# Altium project maXTouch_Xplained_Pro.PRJPCB
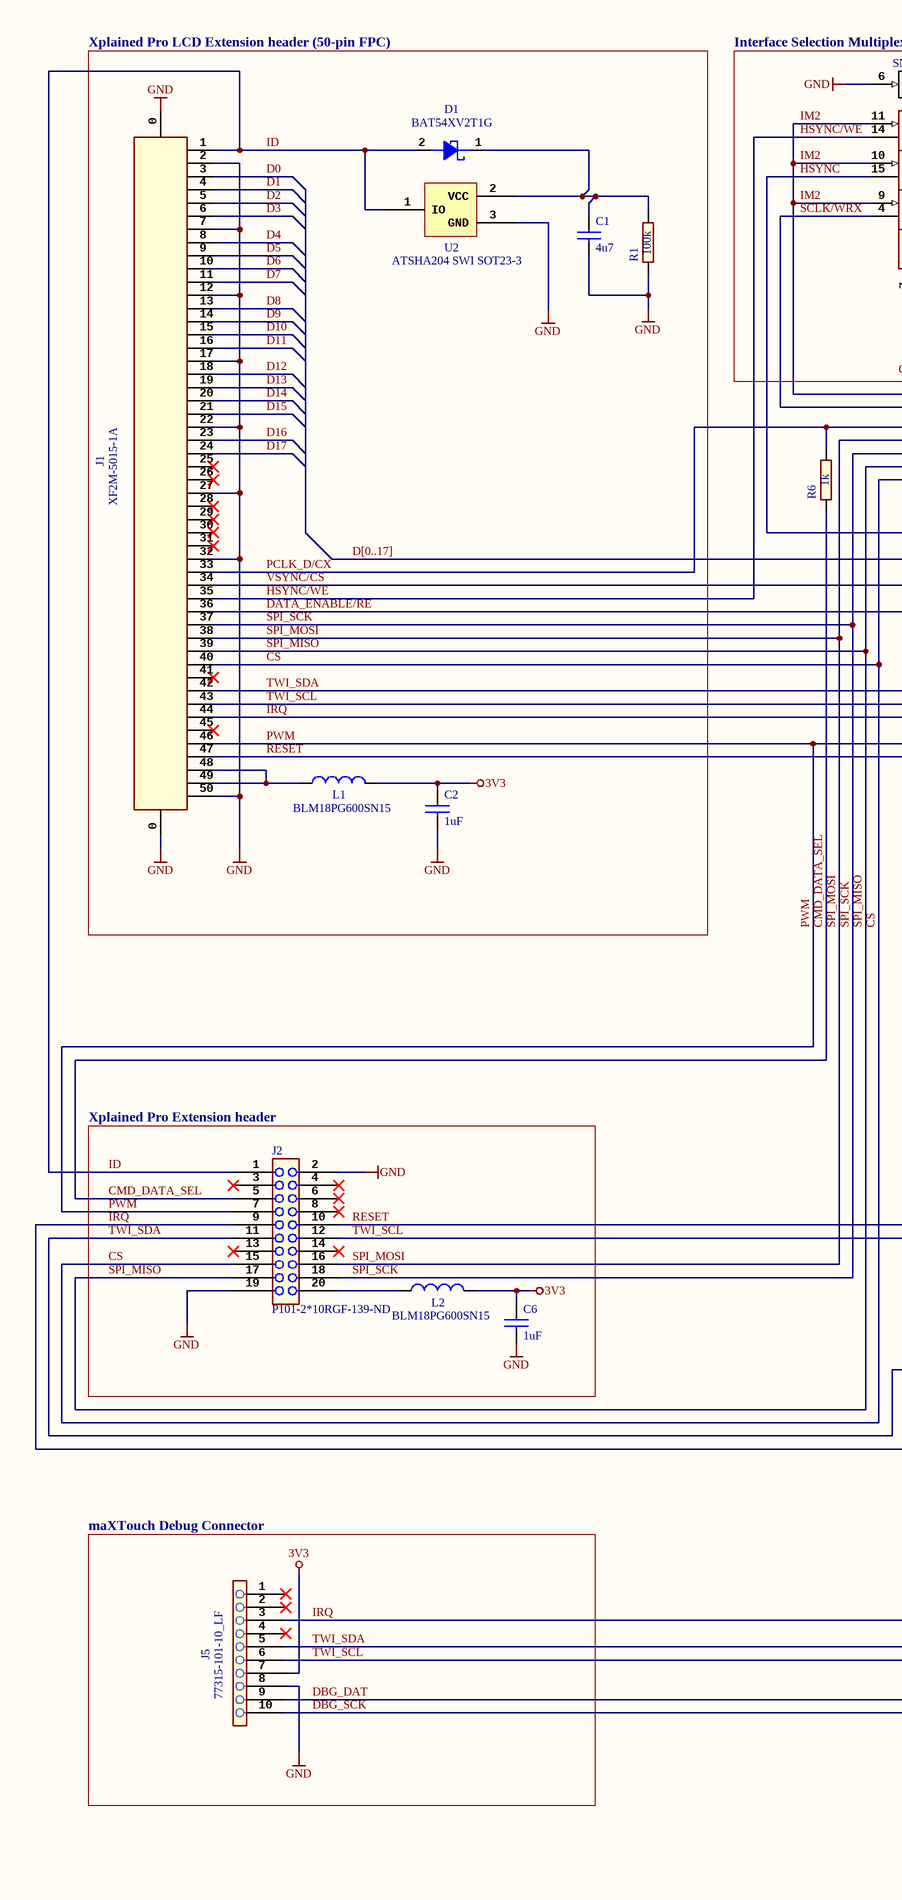
[diagram p0: maXTouch_Xplained_Pro.SCHDOC, left]
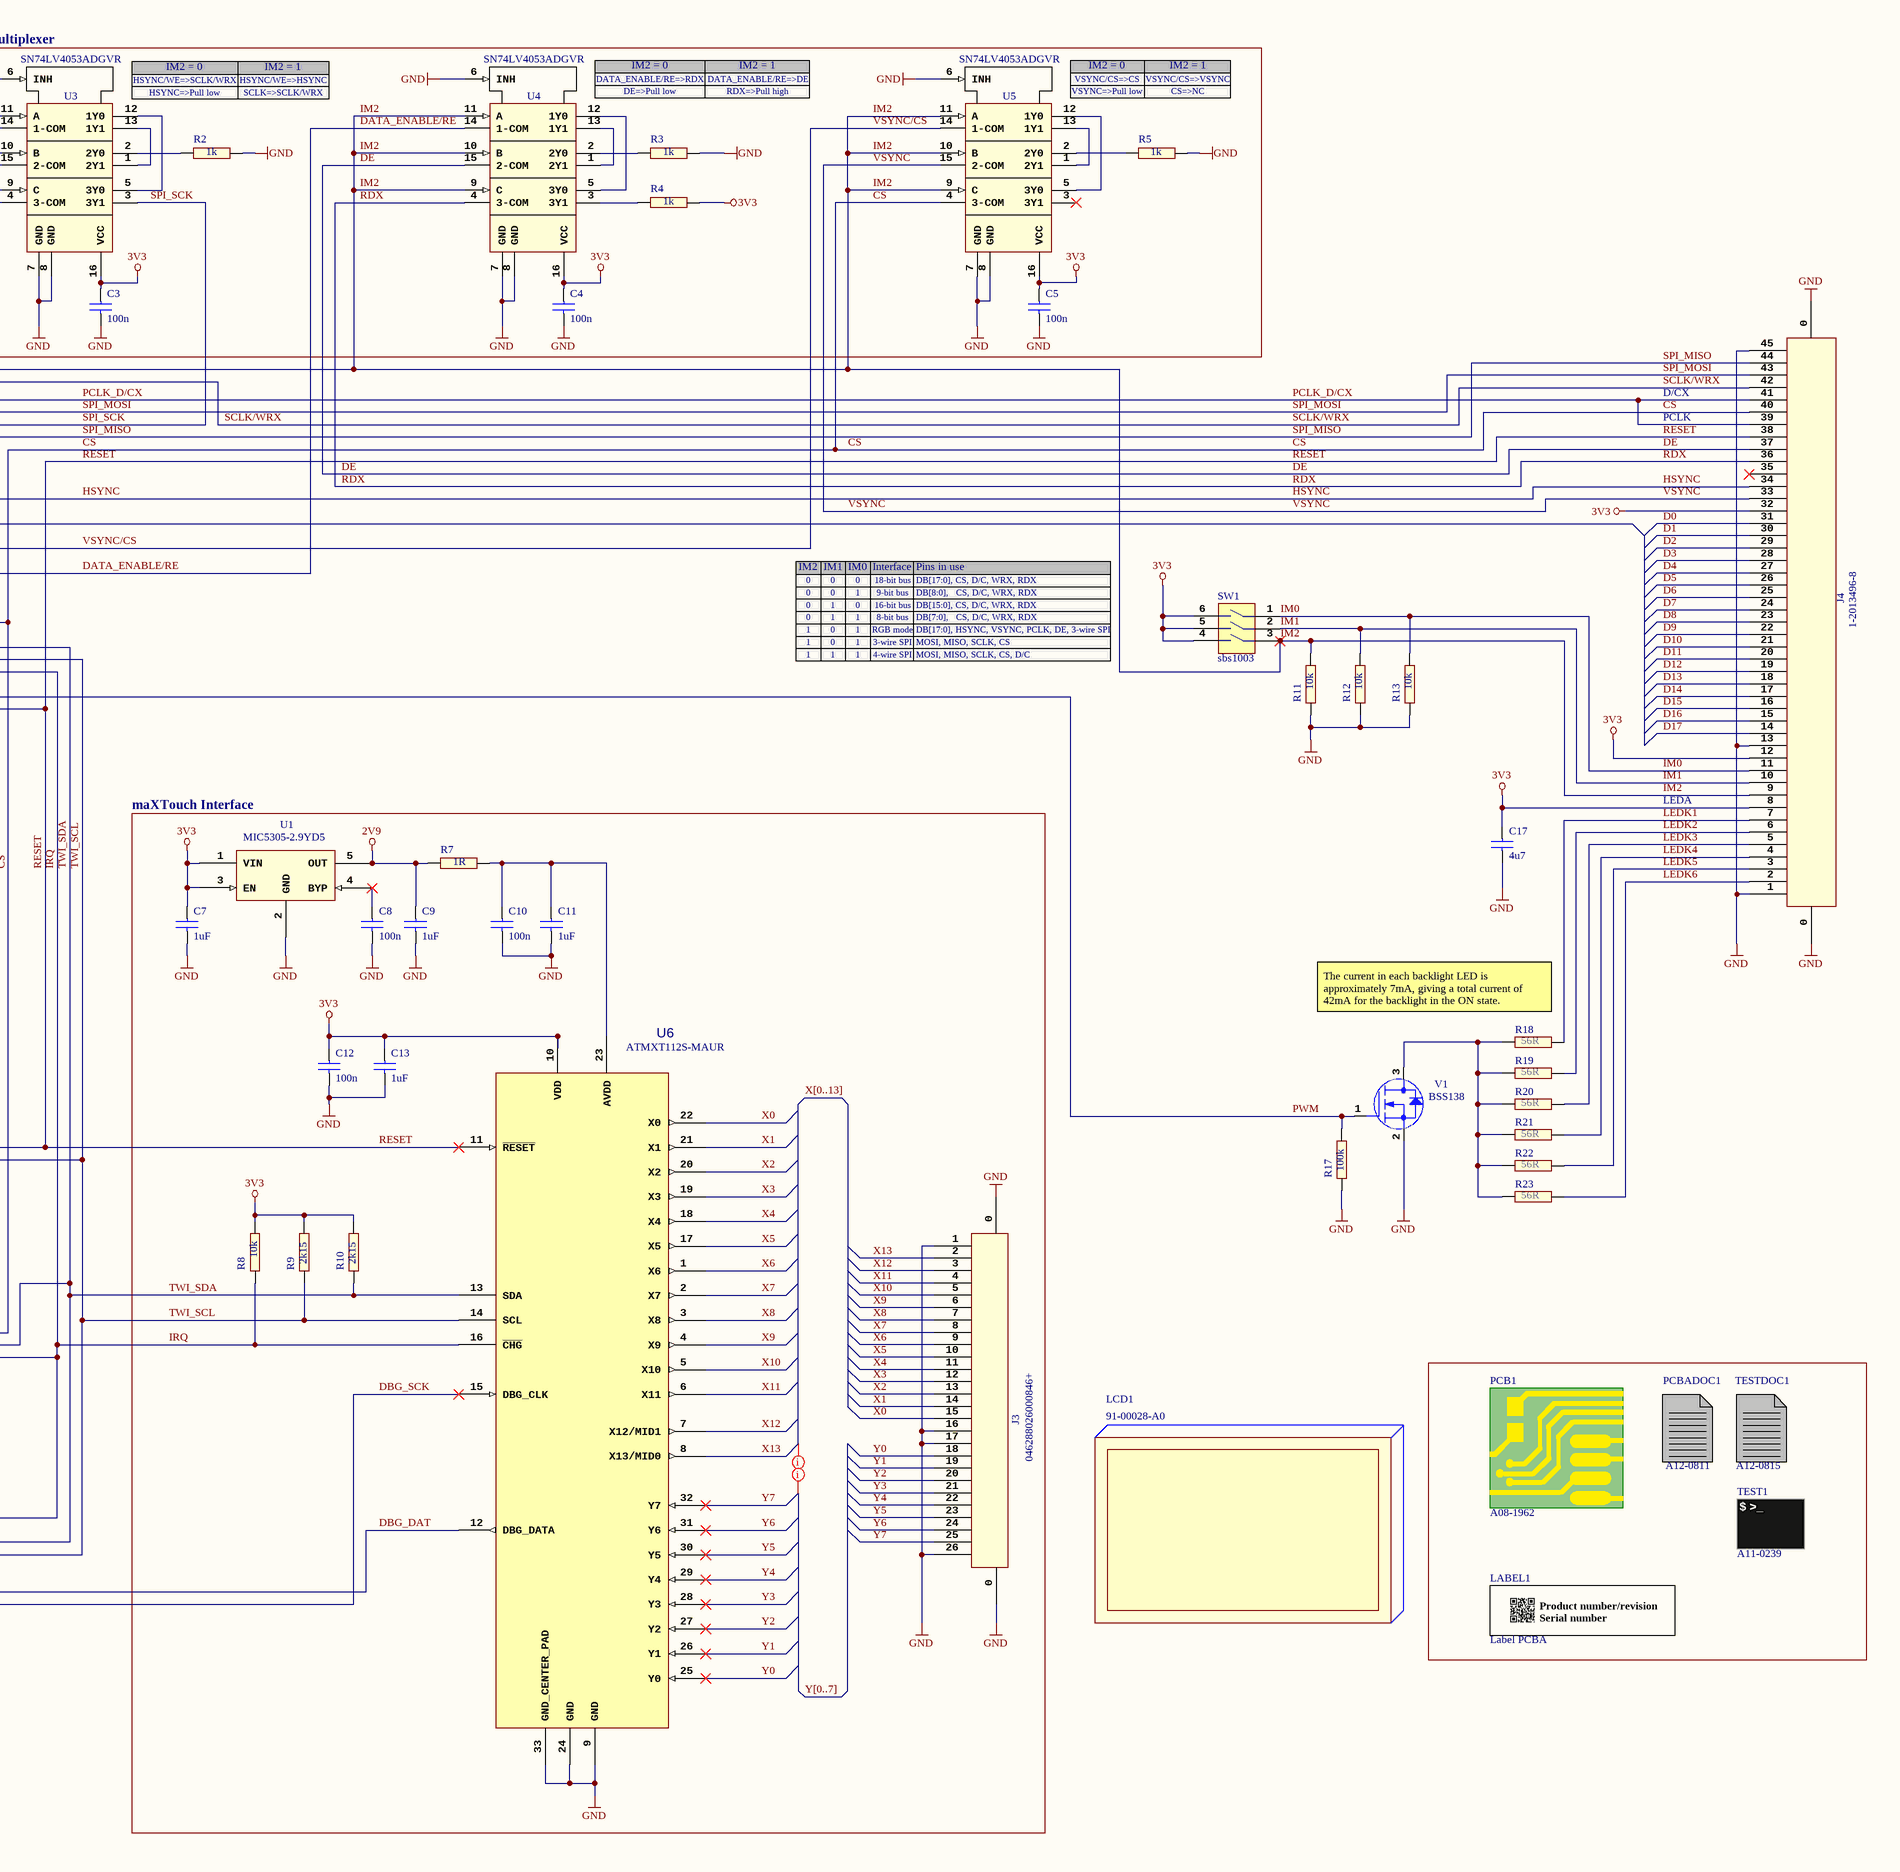
[diagram p1: maXTouch_Xplained_Pro.SCHDOC, right]
1 sheet, 56 parts. Net scope: global (net labels, ports and power ports of the same name join across sheets).
Board file: maXTouch_Xplained_Pro.PCBDOC

## Sheet maXTouch_Xplained_Pro.SCHDOC: maXTouch Xplained Pro
size A2; Organization: ATMEL Norway; Address1: Vestre Rosten 79; Address2: N-7075 TILLER; Address3: NORWAY; DocumentNumber: A09-2171; Revision: 2; SheetNumber: 1; SheetTotal: 1; PageSetup: Record=PageOptions|CenterHorizontal=True|CenterVertical=True|PrintScale=0.37|XCorrection=1.00|YCorrection=1.00|PrintKind=1|BorderSize=5000000|LeftOffset=0|BottomOffset=0|Orientation=1|PaperLength=1000|PaperWidth=1000|Scale=100|PaperSource=15|PrintQuality=4000|MediaType=1|DitherType=10|PaperKind=A4|PrintScaleMode=1

### Parts
C1  value 4u7  [AP1-00002]  (hidden comment: CAP-NONPOL)
C2  value 1uF  [AP1-00038]  (hidden comment: CAP-NONPOL)
C3  value 100n  [AP1-00001]  (hidden comment: CAP-NONPOL)
C4  value 100n  [AP1-00001]  (hidden comment: CAP-NONPOL)
C5  value 100n  [AP1-00001]  (hidden comment: CAP-NONPOL)
C6  value 1uF  [AP1-00038]  (hidden comment: CAP-NONPOL)
C7  value 1uF  [AP1-00038]  (hidden comment: CAP-NONPOL)
C8  value 100n  [AP1-00001]  (hidden comment: CAP-NONPOL)
C9  value 1uF  [AP1-00038]  (hidden comment: CAP-NONPOL)
C10  value 100n  [AP1-00001]  (hidden comment: CAP-NONPOL)
C11  value 1uF  [AP1-00038]  (hidden comment: CAP-NONPOL)
C12  value 100n  [AP1-00001]  (hidden comment: CAP-NONPOL)
C13  value 1uF  [AP1-00038]  (hidden comment: CAP-NONPOL)
C17  value 4u7  [AP1-00002]  (hidden comment: CAP-NONPOL)
D1  value BAT54XV2T1G  [AP4-00036]  (hidden comment: Farnell# 1615809)
J1  value XF2M-5015-1A  [AP8-00718]  (hidden comment: Farnell no: 1112564)
J2  value P101-2*10RGF-139-ND  [AP8-00622]  (hidden comment: HEADER 2x10)
J3  value 046288026000846+  [AP8-00820]  (hidden comment: CONNECTOR_26pin)
J4  1-2013496-8  [AP8-00794]
J5  value 77315-101-10_LF  [AP8-00791]
L1  value BLM18PG600SN15  [AP3-00005]  (hidden comment: INDUCTOR)
L2  value BLM18PG600SN15  [AP3-00005]  (hidden comment: INDUCTOR)
LABEL1  value Label PCBA  [AP8-00317]  (hidden comment: LBL1)
LCD1  value 91-00028-A0  [AP9-00111]  (hidden comment: LCD_COLOR)
PCB1  AN: A08-1962  (hidden comment: PCB)  (mechanical)
PCBADOC1  AN: A12-0811  (hidden comment: PCBADOC)  (mechanical)
R1  value 100k  [AP2-00000]  (hidden comment: R2)
R2  value 1k  [AP2-00000]  (hidden comment: R2)
R3  value 1k  [AP2-00000]  (hidden comment: R2)
R4  value 1k  [AP2-00000]  (hidden comment: R2)
R5  value 1k  [AP2-00000]  (hidden comment: R2)
R6  value 1k  [AP2-00000]  (hidden comment: R2)
R7  value 1R  [AP2-00000]  (hidden comment: R2)
R8  value 10k  [AP2-00000]  (hidden comment: R2)
R9  value 2k15  [AP2-00000]  (hidden comment: R2)
R10  value 2k15  [AP2-00000]  (hidden comment: R2)
R11  value 10k  [AP2-00000]  (hidden comment: R2)
R12  value 10k  [AP2-00000]  (hidden comment: R2)
R13  value 10k  [AP2-00000]  (hidden comment: R2)
R17  value 100k  [AP2-00011]  (hidden comment: R2)
R18  value 56R  [AP2-00011]  (hidden comment: R2)
R19  value 56R  [AP2-00011]  (hidden comment: R2)
R20  value 56R  [AP2-00011]  (hidden comment: R2)
R21  value 56R  [AP2-00011]  (hidden comment: R2)
R22  value 56R  [AP2-00011]  (hidden comment: R2)
R23  value 56R  [AP2-00011]  (hidden comment: R2)
SW1  value sbs1003  [AP8-00792]  (hidden comment: Switch_DIL_3-Pos)
TEST1  AN: A11-0239  (hidden comment: TEST)  (mechanical)
TESTDOC1  AN: A12-0815  (hidden comment: TESTDOC)  (mechanical)
U1  MPN: MIC5305-2.9YD5  [AP6-00014]  (hidden comment: VOLTREG)
U2  value ATSHA204 SWI SOT23-3  [AP4-00018]  (hidden comment: ATSHA204_SOT23)
U3  SN74LV4053ADGVR  [AP6-00367]
U4  SN74LV4053ADGVR  [AP6-00367]
U5  SN74LV4053ADGVR  [AP6-00367]
U6  value ATMXT112S-MAUR  [AP6-00368]  (hidden comment: MXT112S-MAU)
V1  value BSS138  [AP5-00002]  (hidden comment: MOSFET_N_GSD)

### Blocks framed on the sheet
Xplained Pro LCD Extension header (50-pin FPC): C1 C2 D1 J1 L1 R1 U2
Interface Selection Multiplexer: C3-C5 R2-R5 U3-U5
maXTouch Interface: C7-C13 J3 R7-R10 U1 U6
Xplained Pro Extension header: C6 J2 L2
maXTouch Debug Connector: J5

### Nets
2V9: C9.1 R7.1 U1.5(OUT)
3V3: C2.1 C3.1 C4.1 C5.1 C6.1 C7.1 C12.1 C13.1 C17.1 J4.8 J4.12 J4.32 J5.7 L1.2 L2.2 R4.2 R8.2 R9.2 R10.2 SW1.4 SW1.5 SW1.6 U1.1(VIN) U1.3(EN) U3.16(VCC) U4.16(VCC) U5.16(VCC) U6.10(VDD)
GND: C1.2 C2.2 C3.2 C4.2 C5.2 C6.2 C7.2 C8.2 C9.2 C10.2 C11.2 C12.2 C13.2 C17.2 J1.0 J1.2 J1.7 J1.12 J1.17 J1.22 J1.27 J1.32 J1.50 J2.2 J2.19 J3.0 J3.1 J3.16 J3.17 J3.26 J4.0 J4.1 J4.13 J4.45 J5.8 R1.1 R2.2 R3.2 R5.2 R11.1 R12.1 R13.1 R17.1 U1.2(GND) U2.3(GND) U3.6(INH) U3.7(GND) U3.8(GND) U4.6(INH) U4.7(GND) U4.8(GND) U5.6(INH) U5.7(GND) U5.8(GND) U6.9(GND) U6.24(GND) U6.33(GND_CENTER_PAD) V1.2(S)
CMD_DATA_SEL: J2.5 R6.2
CS: J1.40 J2.15 J4.40 U5.4(3-COM)
D0: J1.3 J4.31
D1: J1.4 J4.30
D2: J1.5 J4.29
D3: J1.6 J4.28
D4: J1.8 J4.27
D5: J1.9 J4.26
D6: J1.10 J4.25
D7: J1.11 J4.24
D8: J1.13 J4.23
D9: J1.14 J4.22
D10: J1.15 J4.21
D11: J1.16 J4.20
D12: J1.18 J4.19
D13: J1.19 J4.18
D14: J1.20 J4.17
D15: J1.21 J4.16
D16: J1.23 J4.15
D17: J1.24 J4.14
DATA_ENABLE/RE: J1.36 U4.14(1-COM)
DBG_DAT: J5.9 U6.12(DBG_DATA)
DBG_SCK: J5.10 U6.15(DBG_CLK)
DE: J4.37 U4.15(2-COM)
HSYNC: J4.34 U3.15(2-COM)
HSYNC/WE: J1.35 U3.14(1-COM)
ID: D1.2(ANODE) J1.1 J2.1 U2.1(IO)
IM0: J4.11 R13.2 SW1.1
IM1: J4.10 R12.2 SW1.2
IM2: J4.9 R11.2 SW1.3 U3.9(C) U3.10(B) U3.11(A) U4.9(C) U4.10(B) U4.11(A) U5.9(C) U5.10(B) U5.11(A)
IRQ: J1.44 J2.9 J5.3 R8.1 U6.16(~{CHG})
LEDK1: J4.7 R18.2
LEDK2: J4.6 R19.2
LEDK3: J4.5 R20.2
LEDK4: J4.4 R21.2
LEDK5: J4.3 R22.2
LEDK6: J4.2 R23.2
PCLK_D/CX: J1.33 J4.39 J4.41 R6.1
PWM: J1.46 J2.7 R17.2 V1.1(G)
RDX: J4.36 U4.4(3-COM)
RESET: J1.47 J2.10 J4.38 U6.11(~{R}~{E}~{S}~{E}~{T})
SCLK/WRX: J4.42 U3.4(3-COM)
SPI_MISO: J1.39 J2.17 J4.44
SPI_MOSI: J1.38 J2.16 J4.43
SPI_SCK: J1.37 J2.18 U3.3(3Y1)
TWI_SCL: J1.43 J2.12 J5.6 R9.1 U6.14(SCL)
TWI_SDA: J1.42 J2.11 J5.5 R10.1 U6.13(SDA)
VSYNC: J4.33 U5.15(2-COM)
VSYNC/CS: J1.34 U5.14(1-COM)
X0: J3.15 U6.22(X0)
X1: J3.14 U6.21(X1)
X2: J3.13 U6.20(X2)
X3: J3.12 U6.19(X3)
X4: J3.11 U6.18(X4)
X5: J3.10 U6.17(X5)
X6: J3.9 U6.1(X6)
X7: J3.8 U6.2(X7)
X8: J3.7 U6.3(X8)
X9: J3.6 U6.4(X9)
X10: J3.5 U6.5(X10)
X11: J3.4 U6.6(X11)
X12: J3.3 U6.7(X12/MID1)
X13: J3.2 U6.8(X13/MID0)
Y0: J3.18 U6.25(Y0)
Y1: J3.19 U6.26(Y1)
Y2: J3.20 U6.27(Y2)
Y3: J3.21 U6.28(Y3)
Y4: J3.22 U6.29(Y4)
Y5: J3.23 U6.30(Y5)
Y6: J3.24 U6.31(Y6)
Y7: J3.25 U6.32(Y7)
NetC1_1: C1.1 D1.1(CATHODE) R1.2 U2.2(VCC)
NetC8_1: C8.1 U1.4(BYP)
NetC10_1: C10.1 C11.1 R7.2 U6.23(AVDD)
NetJ1_48: J1.48 J1.49 L1.1
NetJ2_20: J2.20 L2.1
NetR2_1: R2.1 U3.2(2Y0)
NetR3_1: R3.1 U4.2(2Y0)
NetR4_1: R4.1 U4.3(3Y1)
NetR5_1: R5.1 U5.2(2Y0)
NetR18_1: R18.1 R19.1 R20.1 R21.1 R22.1 R23.1 V1.3(D)
NetU3_1: U3.1(2Y1) U3.13(1Y1)
NetU3_5: U3.5(3Y0) U3.12(1Y0)
NetU4_1: U4.1(2Y1) U4.13(1Y1)
NetU4_5: U4.5(3Y0) U4.12(1Y0)
NetU5_1: U5.1(2Y1) U5.13(1Y1)
NetU5_5: U5.5(3Y0) U5.12(1Y0)

Not connected (* = marked no-connect by the designer): J1 25* 26* 28* 29* 30* 31* 41* 45*; J2 3* 4* 6* 8* 13* 14*; J4 35*; J5 1* 2* 4*; U5 3(3Y1)*

### Buses and harness runs
bus D[0..17]
bus X[0..13]
bus Y[0..7]

### Layout directives
rule Assembly Testpoint Usage [Testpoint - Not Allowed    Multiple - Not Allowed]: (no net found under the mark)

### Notes on the sheet
- (near U3) HSYNC/WE=>SCLK/WRX
- IM2 = 0
- HSYNC/WE=>HSYNC
- IM2 = 1
- (near U4) DATA_ENABLE/RE=>RDX
- DATA_ENABLE/RE=>DE
- (near U5) VSYNC/CS=>CS
- (near U5) IM2 = 0
- VSYNC/CS=>VSYNC
- HSYNC=>Pull low
- SCLK=>SCLK/WRX
- DE=>Pull low
- RDX=>Pull high
- (near U5) VSYNC=>Pull low
- CS=>NC
- D/CX
- PCLK
- IM2
- IM1
- IM0
- Interface
- Pins in use
- 1
- 0
- RGB mode
- 18-bit bus
- 16-bit bus
- 9-bit bus
- 8-bit bus
- DB[17:0], CS, D/C, WRX, RDX
- DB[8:0],   CS, D/C, WRX, RDX
- DB[15:0], CS, D/C, WRX, RDX
- DB[7:0],   CS, D/C, WRX, RDX
- DB[17:0], HSYNC, VSYNC, PCLK, DE, 3-wire SPI
- 3-wire SPI
- 4-wire SPI
- MOSI, MISO, SCLK, CS
- MOSI, MISO, SCLK, CS, D/C
- LEDA
- (near R18) The current in each backlight LED is approximately 7mA, giving a total current of 42mA for the backlight in the ON state.
- Document number:
- Date:
- PAGE:
- Revision:
- of
- TITLE:
- (in symbol A09-0611) / Product number/revision / Serial number
- (in symbol A11-0239) $ >_

### Library data of the parts
C1 C17 = A01-0305: Ceramic capacitor, SMD 0603, 10V, ±10%; PartGroup: Capacitors,Ceramic,SMD 0603; AN: A01-0305; Tolerance: 10V, ±10%
C2 C6 C7 C9 C11 C13 = A01-0447: Ceramic capacitor, SMD 0402, X5R, 10V, ±10 %; PartGroup: Capacitors,Ceramic,SMD 0402; Manufacturer: AVX; MPN: 0402ZD105KAT2A; AN: A01-0447; Height: 0.560000002384186
C3-C5 C8 C10 C12 = A01-0246: Ceramic capacitor, SMD 0402, X7R, 16V, +/-10%; PartGroup: Capacitors,Ceramic,SMD 0402; Manufacturer: Kemet; MPN: C0402C104K4RACTU; TemperatureRange: -55 - +125 deg C; AN: A01-0246; Tolerance: 16V, +/-10%; Height: 0.5
D1 = A04-0049: Schottky diode, If:200mA, Vf:0.35V, Vrrm:30V, SOD-523; PartGroup: Diodes,Schottky; Manufacturer: ON Semiconductor; TemperatureRange: -55°C to +125°C; AN: A04-0049; Height: 0.699999988079071; MPN: BAT54XV2T1G
J1 = A08-1731: 50pin FPC connector, 0.5mm pitch, Top/Bottom contacts; PartGroup: Mechanical devices,Connectors,PCB - receptacle; Manufacturer: Omron Components; TemperatureRange: -30°C to +85°C; AN: A08-1731; Height: 3.20000004768372; MPN: XF2M-5015-1A
J2 = A08-1513: Pin header, 2x10, Right Angle, 2.54mm, THM, Pin In Paste; PartGroup: Mechanical devices,Connectors,Pin headers; Manufacturer: Pro-data International Corp; AN: A08-1513; MPN: P101-2*10RGF-139-ND
J3 = A08-2014: 26pin ZIF right angle 0.5mm pitch; PartGroup: Mechanical devices,Connectors,PCB - receptacle; AN: A08-2014; Height: 2
J4 = A08-1955: 45 pin, bottom side,  FPC connector, 0.3mm pitch; PartGroup: Mechanical devices,Connectors,Other; Manufacturer: TE Connectivity; AN: A08-1955; Value: 1-2013496-8; Design comment: *; MPN: 1-2013496-8
J5 = A08-1949: 1x10 Pin Header,2.54mm pitch, right angle.THM; PartGroup: Mechanical devices,Connectors,Pin headers; Manufacturer: FCI; AN: A08-1949; MPN: 77315-101-10_LF
L1 L2 = A03-0164: SMD EF inductor 0603. Z=60ohm(@100MHz),Max R(dc)=0.10ohm,Max current=500mA; PartGroup: Inductors,EMI; TemperatureRange: -55-+125 deg.C; AN: A03-0164
LABEL1 = A09-0611: PCBA identification label PP Top White Gloss; PartGroup: Mechanical devices,Packaging materials,Printed Labels; Manufacturer: ACT Logimark AS; MPN: 505462; AN: A09-0611
LCD1 = A10-0132: 3.5in HGVA TFT LCD; PartGroup: Opto,LCD; Manufacturer: Precision Design Associates (PDA); AN: A10-0132; MPN: 91-00028-A0
PCB1 = A08-1962: maXTouch Xplained Pro PCB; PartGroup: Mechanical devices,Printed circuit boards; Value: maXTouch Xplained Pro PCB
PCBADOC1 = A12-0811: maXTouch Xplained Pro PCBA Documentation; PartGroup: Documentation,PCBA Documents,Sub-Contractors,Escatec Technology; Value: A09-2171 PCBA Files
R1 R17 = A02-0260: Thick film resistor, SMD 0402, 1/16W, 1%; PartGroup: Resistors,SMD,0402 1%; TemperatureRange: -55ï¿½ to +125ï¿½C; AN: A02-0260; Tolerance: 1 %; Height: 0.349999994039536
R2-R6 = A02-0212: Thick film resistor, SMD 0402, 1/16W, 1%; PartGroup: Resistors,SMD,0402 1%; TemperatureRange: -55 - +125 deg C; AN: A02-0212; Tolerance: 1 %; Height: 0.349999994039536
R7 = A02-0828: SMD 0402, 1/16W, 1%; PartGroup: Resistors,SMD,0402 1%; AN: A02-0828
R8 R11-R13 = A02-0236: Thick film resistor, SMD 0402, 1/16W, 1%; PartGroup: Resistors,SMD,0402 1%; Manufacturer: vishay; MPN: CRCW040210K0FKED; TemperatureRange: -55 - +125 deg C; AN: A02-0236; Tolerance: 1 %; Height: 0.349999994039536
R9 R10 = A02-0812: SMD 0402, 1/16W,1%; PartGroup: Resistors,SMD,0402 1%; AN: A02-0812
R18-R23 = A02-0182: Thick film resistor, SMD 0402, 1/16W, 1%; PartGroup: Resistors,SMD,0402 1%; TemperatureRange: -55 - +125 deg C; AN: A02-0182; Tolerance: 1 %; Height: 0,349999994039536
SW1 = A08-1950: DIL Switch, 3-poles, 2.54mm; PartGroup: Mechanical devices,Switches,SMD; Manufacturer: Knitter-Switch; AN: A08-1950; MPN: sbs1003
TEST1 = A11-0239: maXTouch Xplained pro Fixture Test SW; PartGroup: Software,Test software,Sub-Contractors,Escatec Technology; Value: maXTouch Xplained pro Fixture Test SW
TESTDOC1 = A12-0815: maXTouch Xplained Pro test instruction; PartGroup: Documentation,Procedures,Test Instructions; Value: maXTouch Xplained Pro test instruction
U1 = A06-1056: 150mA uCap Ultra-low dropout LDO Regulator; PartGroup: Integrated Circuits,Regulators,Linear; Manufacturer: MICREL SEMICONDUCTOR; AN: A06-1056; Height: 1
U2 = A06-0571: ATSHA204 with 1-wire interface and SOT23-3 package; PartGroup: Integrated Circuits,Special function,Encryption; Manufacturer: ATMEL; MPN: ATSHA204-TSU-T; TemperatureRange: &#8722;40°C to +85°C; AN: A06-0571; Height: 1.12000000476837
U3-U5 = A06-1057: Triple 2-channel analog multiplexers/demultiplexers; PartGroup: Integrated Circuits,General linear,Analog switch, bus switch and MUX; Manufacturer: Texas Instruments; TemperatureRange: -40 to 85; AN: A06-1057; Value: SN74LV4053ADGVR; Height: 1.20000004768372; MPN: SN74LV4053ADGVR
U6 = A06-1059: QFN32 ATMXT112S-MAU 112-channel touchscreen controller; PartGroup: Integrated Circuits,Special function,Touch Sense; Manufacturer: ATMEL; AN: A06-1059; MPN: ATMXT112S-MAUR
V1 = A05-0071: N-Channel MOSFET. 50V, 0.22A continuous, 0.88A Peak. RDS(ON) = 3.5Ohm@VGS=10V, VGS(th)<1.5V; PartGroup: Transistors,Small signal FET,SMD; Manufacturer: Fairchild; TemperatureRange: -55 ï¿½C to +150 ï¿½C; AN: A05-0071; Height: 1.10000002384186; MPN: BSS138

## Assembly variants
maXTouch_Xplained_Pro: not fitted C14 C15 C16 D2 J5 L3 L4 R9 R10 R15 R16 U7